# EAGLE schematic official (EAGLE 6.3)
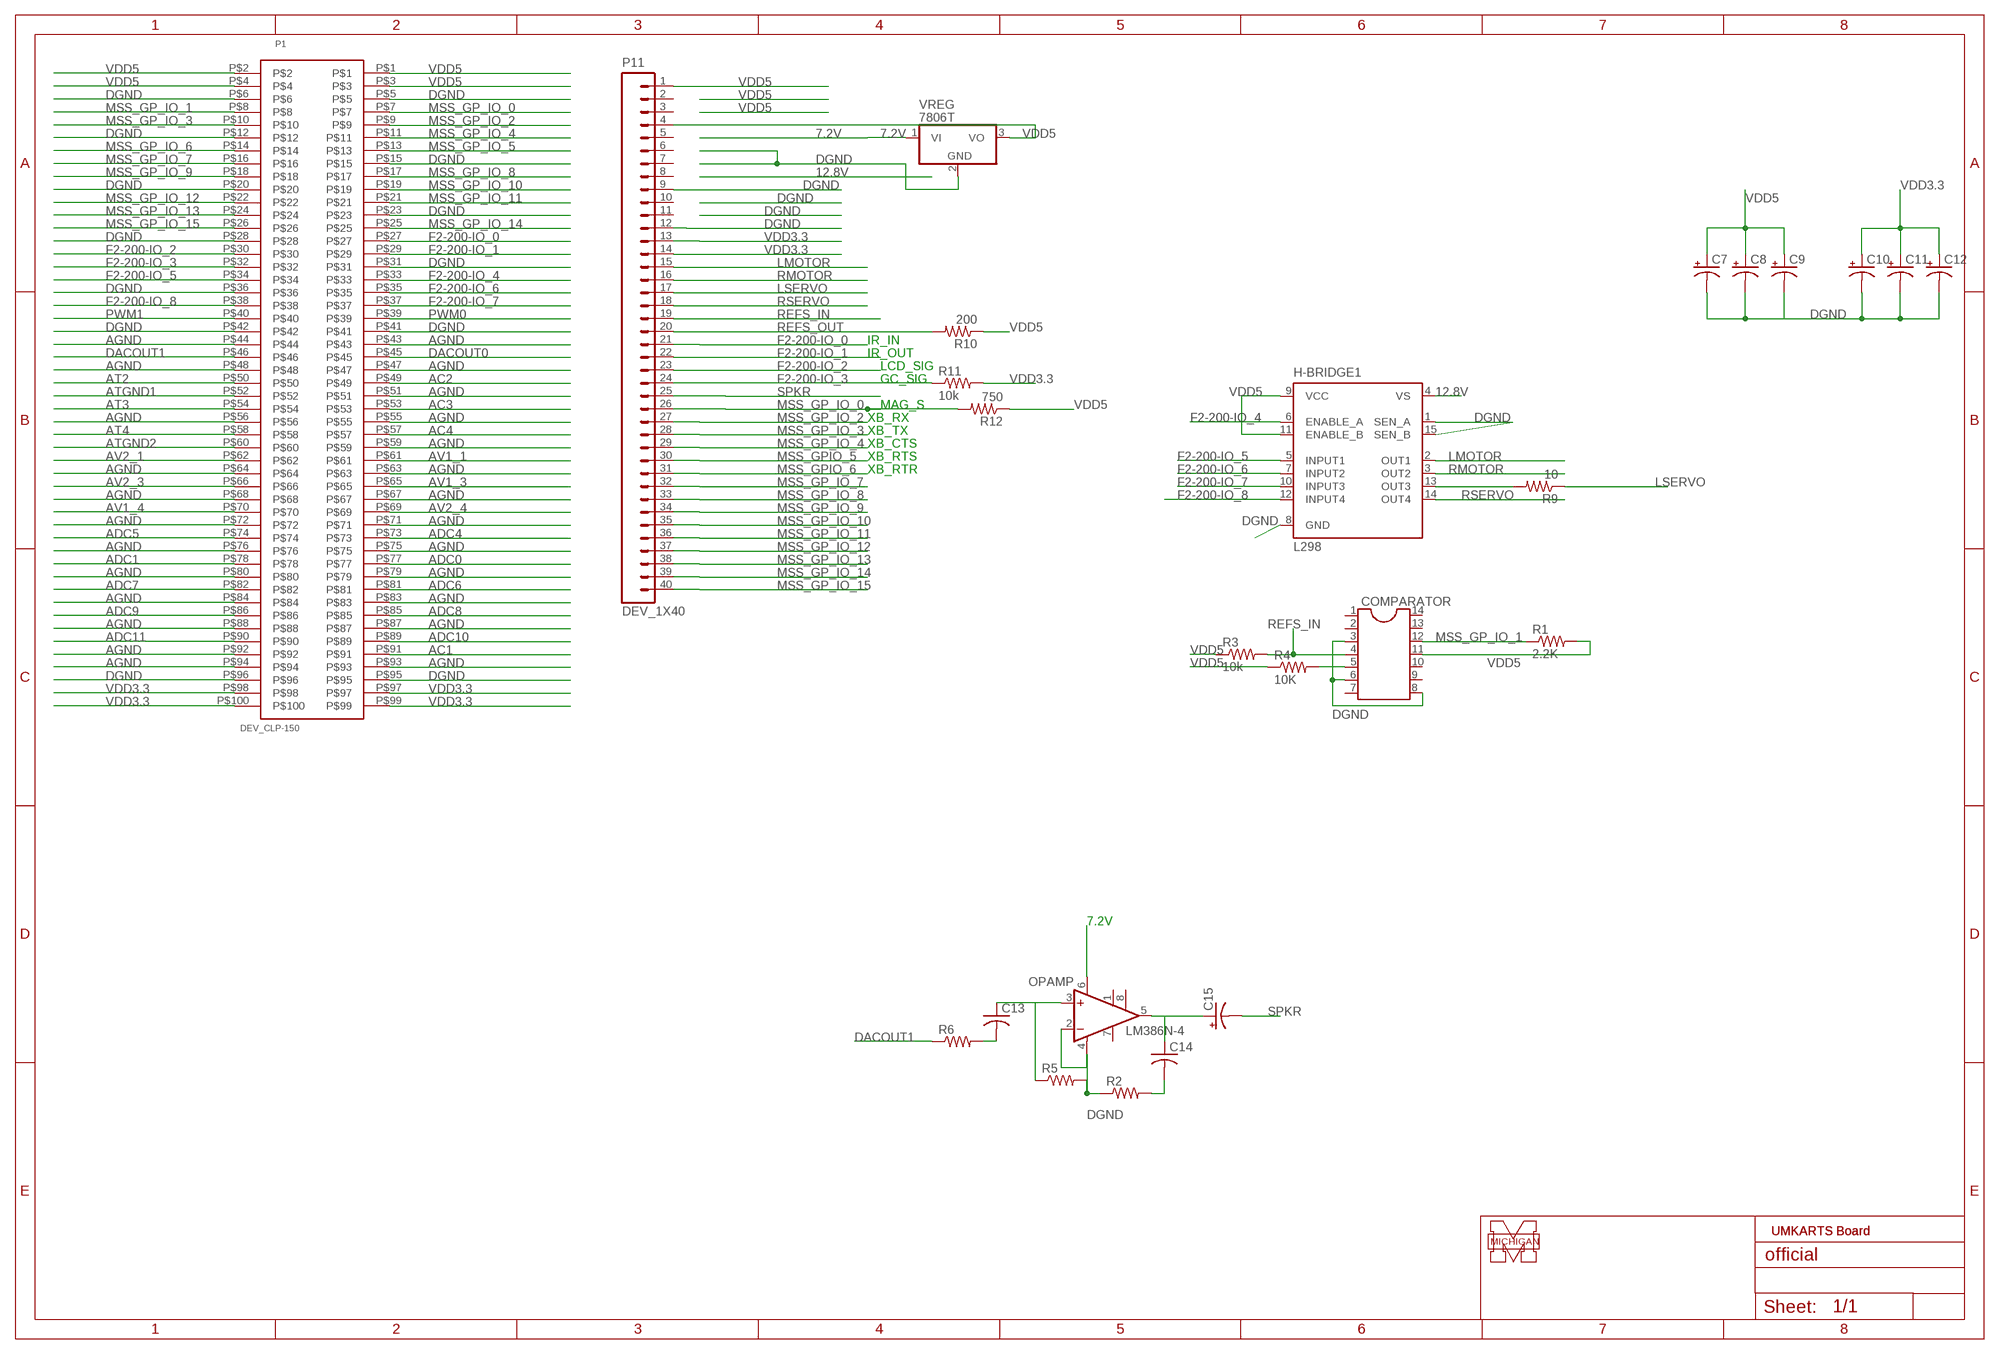
[diagram p0: schematic, sheet 1]

## Parts
C7  CPOL-USB45181B  [B45181B]
C8  CPOL-USB45181B  [B45181B]
C9  CPOL-USB45181B  [B45181B]
C10  CPOL-USB45181B  [B45181B]
C11  CPOL-USB45181B  [B45181B]
C12  CPOL-USB45181B  [B45181B]
C13  C-US075-032X103  [C075-032X103]
C14  C-US025-025X050  [C025-025X050]
C15  CPOL-USB45181B  [B45181B]
COMPARATOR  DIL14S  [SOCKET-14]
H-BRIDGE1  L298  [MULTIWATT-15]
OPAMP  LM386N-4  [DIL08]
P1  DEV_CLP-150  [CLP-150]
P11  DEV_1X40  [1X40]
R1  2.2K  R-US_0207/12  [0207/12]
R2  R-US_0207/12  [0207/12]
R3  10k  R-US_0309/12  [0309/12]
R4  10K  R-US_0309/12  [0309/12]
R5  R-US_0207/12  [0207/12]
R6  R-US_0207/12  [0207/12]
R9  10  R-US_0309/12  [0309/12]
R10  200  R-US_0309/12  [0309/12]
R11  10k  R-US_0309/12  [0309/12]
R12  750  R-US_0309/12  [0309/12]
VREG  7806T  [TO220H]

## Nets
7.2V: VREG.1(VI)
12.8V: H-BRIDGE1.4(VS)
AC1: P1.P$91
AC2: P1.P$49
AC3: P1.P$53
AC4: P1.P$57
ADC0: P1.P$77
ADC1: P1.P$78
ADC4: P1.P$73
ADC5: P1.P$74
ADC6: P1.P$81
ADC7: P1.P$82
ADC8: P1.P$85
ADC9: P1.P$86
ADC10: P1.P$89
ADC11: P1.P$90
AGND: P1.P$43 P1.P$44 P1.P$47 P1.P$48 P1.P$51 P1.P$55 P1.P$56 P1.P$59 P1.P$63 P1.P$64 P1.P$67 P1.P$68 P1.P$71 P1.P$72 P1.P$75 P1.P$76 P1.P$79 P1.P$80 P1.P$83 P1.P$84 P1.P$87 P1.P$88 P1.P$92 P1.P$93 P1.P$94
AT2: P1.P$50
AT3: P1.P$54
AT4: P1.P$58
ATGND1: P1.P$52
ATGND2: P1.P$60
AV1_1: P1.P$61
AV1_3: P1.P$65
AV1_4: P1.P$70
AV2_1: P1.P$62
AV2_3: P1.P$66
AV2_4: P1.P$69
DACOUT0: P1.P$45
DACOUT1: P1.P$46 R6.1
DGND: C7.- C8.- C9.- C10.- C11.- C12.- COMPARATOR.3 COMPARATOR.6 COMPARATOR.8 H-BRIDGE1.1(SEN_A) H-BRIDGE1.8(GND) H-BRIDGE1.15(SEN_B) OPAMP.2(-IN) OPAMP.4(GND) P1.P$5 P1.P$6 P1.P$12 P1.P$15 P1.P$20 P1.P$23 P1.P$28 P1.P$31 P1.P$36 P1.P$41 P1.P$42 P1.P$95 P1.P$96 P11.9 P11.12 R2.1 R5.2 VREG.2(GND)
F2-200-IO_0: P1.P$27 P11.21
F2-200-IO_1: P1.P$29 P11.22
F2-200-IO_2: P1.P$30 P11.23
F2-200-IO_3: P1.P$32 P11.24 R11.1
F2-200-IO_4: H-BRIDGE1.6(ENABLE_A) P1.P$33
F2-200-IO_5: H-BRIDGE1.5(INPUT1) P1.P$34
F2-200-IO_6: H-BRIDGE1.7(INPUT2) P1.P$35
F2-200-IO_7: H-BRIDGE1.10(INPUT3) P1.P$37
F2-200-IO_8: H-BRIDGE1.12(INPUT4) P1.P$38
LMOTOR: H-BRIDGE1.2(OUT1) P11.15
LSERVO: P11.17 R9.1
MSS_GP_IO_0: P1.P$7 P11.26 R12.2
MSS_GP_IO_1: COMPARATOR.12 P1.P$8 R1.1
MSS_GP_IO_2: P1.P$9 P11.27
MSS_GP_IO_3: P1.P$10 P11.28
MSS_GP_IO_4: P1.P$11 P11.29
MSS_GP_IO_5: P1.P$13
MSS_GP_IO_6: P1.P$14
MSS_GP_IO_7: P1.P$16 P11.32
MSS_GP_IO_8: P1.P$17 P11.33
MSS_GP_IO_9: P1.P$18 P11.34
MSS_GP_IO_10: P1.P$19 P11.35
MSS_GP_IO_11: P1.P$21 P11.36
MSS_GP_IO_12: P1.P$22 P11.37
MSS_GP_IO_13: P1.P$24 P11.38
MSS_GP_IO_14: P1.P$25 P11.39
MSS_GP_IO_15: P1.P$26 P11.40
MSS_GPIO_5: P11.30
MSS_GPIO_6: P11.31
N$1: H-BRIDGE1.13(OUT3) R9.2
N$2: C13.1 OPAMP.3(+IN) R5.1
N$3: COMPARATOR.5 R4.2
N$4: C14.2 R2.2
N$5: C14.1 C15.+ OPAMP.5(OUT)
N$6: OPAMP.6(VS)
N$9: C13.2 R6.2
PWM0: P1.P$39
PWM1: P1.P$40
REFS_IN: COMPARATOR.4 P11.19 R3.2
REFS_OUT: P11.20 R10.2
RMOTOR: H-BRIDGE1.3(OUT2) P11.16
RSERVO: H-BRIDGE1.14(OUT4) P11.18
SPKR: C15.- P11.25
VDD3.3: C10.+ C11.+ C12.+ P1.P$97 P1.P$98 P1.P$99 P1.P$100 P11.13 P11.14 R11.2
VDD5: C7.+ C8.+ C9.+ COMPARATOR.11 H-BRIDGE1.9(VCC) H-BRIDGE1.11(ENABLE_B) P1.P$1 P1.P$2 P1.P$3 P1.P$4 P11.1 P11.4 R1.2 R3.1 R4.1 R10.1 R12.1 VREG.3(VO)
Unconnected: COMPARATOR.1 COMPARATOR.2 COMPARATOR.7 COMPARATOR.9 COMPARATOR.10 COMPARATOR.13 COMPARATOR.14 OPAMP.1(GAIN) OPAMP.7(BYPASS) OPAMP.8(GAIN) P11.2 P11.3 P11.5 P11.6 P11.7 P11.8 P11.10 P11.11

## Notes on the sheet
- IR_IN
- IR_OUT
- LCD_SIG
- GC_SIG
- MAG_S
- XB_RX
- XB_TX
- XB_CTS
- XB_RTS
- XB_RTR
- 7.2V
- UMKARTS Board | UMKARTS Board
- MICHIGAN

## Library data of the parts
C7-C12 C15 = rcl:CPOL-US: POLARIZED CAPACITOR, American symbol
C13 C14 = rcl:C-US: CAPACITOR, American symbol
COMPARATOR = ic-package:DIL14: Dual In Line / Socket
H-BRIDGE1 = st-microelectronics:L298: DUAL FULL-BRIDGE DRIVER; MPN: L298N; OC_FARNELL: 1589425; OC_NEWARK: 32M1527
OPAMP = linear:LM386?-*: Low Voltage Audio Power Amplifier Source: http://cache.national.com/ds/LM/LM386.pdf
P1 = EECS370:DEV_CLP-150
P11 = EECS370:DEV_1X40
R1-R6 R9-R12 = rcl:R-US_: RESISTOR, American symbol
VREG = linear:78*: Positive VOLTAGE REGULATOR Source: http://cache.national.com/ds/LM/LM78L05.pdf http://www.fairchildsemi.com/ds/LM/LM7805.pdf